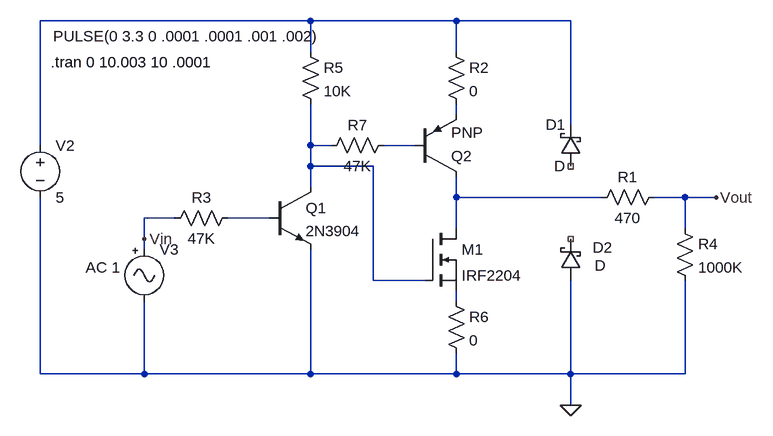
[diagram p0: schematic spank_dig_output_2fet.asc]
spank_dig_output_2fet.asc, the LTspice schematic file:
Version 4
SHEET 1 896 784
WIRE -48 144 -464 144
WIRE 176 144 -48 144
WIRE 352 144 176 144
WIRE -48 192 -48 144
WIRE 176 192 176 144
WIRE 176 288 176 272
WIRE 352 304 352 144
WIRE -464 336 -464 144
WIRE -48 336 -48 272
WIRE -16 336 -48 336
WIRE 112 336 64 336
WIRE -48 368 -48 336
WIRE 48 368 -48 368
WIRE -48 400 -48 368
WIRE 176 416 176 384
WIRE 400 416 176 416
WIRE 528 416 480 416
WIRE 576 416 528 416
WIRE -256 448 -304 448
WIRE -112 448 -176 448
WIRE 176 464 176 416
WIRE 528 464 528 416
WIRE -304 480 -304 448
WIRE -304 496 -304 480
WIRE 48 544 48 368
WIRE 128 544 48 544
WIRE 176 576 176 560
WIRE -464 688 -464 416
WIRE -304 688 -304 576
WIRE -304 688 -464 688
WIRE -48 688 -48 496
WIRE -48 688 -304 688
WIRE 176 688 176 656
WIRE 176 688 -48 688
WIRE 352 688 352 544
WIRE 352 688 176 688
WIRE 528 688 528 544
WIRE 528 688 352 688
WIRE 352 736 352 688
FLAG 352 736 0
FLAG -304 480 Vin
FLAG 576 416 Vout
SYMBOL res 496 400 R90
WINDOW 0 0 56 VBottom 2
WINDOW 3 32 56 VTop 2
SYMATTR InstName R1
SYMATTR Value 470
SYMBOL Misc\\signal -304 480 R0
WINDOW 123 -90 44 Left 2
WINDOW 39 0 0 Left 0
WINDOW 3 -140 -312 Left 2
SYMATTR Value2 AC 1
SYMATTR Value PULSE(0 3.3 0 .0001 .0001 .001 .002)
SYMATTR InstName V3
SYMBOL voltage -464 320 R0
WINDOW 123 0 0 Left 0
WINDOW 39 0 0 Left 0
SYMATTR InstName V2
SYMATTR Value 5
SYMBOL schottky 368 368 R180
WINDOW 0 24 64 Left 2
WINDOW 3 24 0 Left 2
SYMATTR InstName D1
SYMBOL schottky 368 544 R180
WINDOW 0 -49 51 Left 2
WINDOW 3 -38 23 Left 2
SYMATTR InstName D2
SYMBOL nmos 128 464 R0
SYMATTR InstName M1
SYMATTR Value IRF2204
SYMBOL res -160 432 R90
WINDOW 0 0 56 VBottom 2
WINDOW 3 32 56 VTop 2
SYMATTR InstName R3
SYMATTR Value 47K
SYMBOL res 512 448 R0
SYMATTR InstName R4
SYMATTR Value 1000K
SYMBOL res -64 176 R0
SYMATTR InstName R5
SYMATTR Value 10K
SYMBOL npn -112 400 R0
SYMATTR InstName Q1
SYMATTR Value 2N3904
SYMBOL res 160 176 R0
SYMATTR InstName R2
SYMATTR Value 0
SYMBOL res 160 560 R0
SYMATTR InstName R6
SYMATTR Value 0
SYMBOL pnp 112 384 M180
SYMATTR InstName Q2
SYMBOL res 80 320 R90
WINDOW 0 0 56 VBottom 2
WINDOW 3 32 56 VTop 2
SYMATTR InstName R7
SYMATTR Value 47K
TEXT -448 208 Left 2 !.tran 0 10.003 10 .0001

The netlist it stands for:
* spank_dig_output_2fet.asc
R1 Vout N005 470
V3 Vin 0 PULSE(0 3.3 0 .0001 .0001 .001 .002) AC 1
V2 N001 0 5
D1 NC_01 N001 D
D2 0 NC_02 D
M1 N005 N003 N007 N007 IRF2204
R3 N006 Vin 47K
R4 Vout 0 1000K
R5 N001 N003 10K
Q1 N003 N006 0 0 2N3904
R2 N001 N002 0
R6 N007 0 0
Q2 N005 N004 N002 0 PNP
R7 N004 N003 47K
.model D D
.lib standard.dio
.model NPN NPN
.model PNP PNP
.lib standard.bjt
.model NMOS NMOS
.model PMOS PMOS
.lib standard.mos
.tran 0 10.003 10 .0001
.backanno
.end